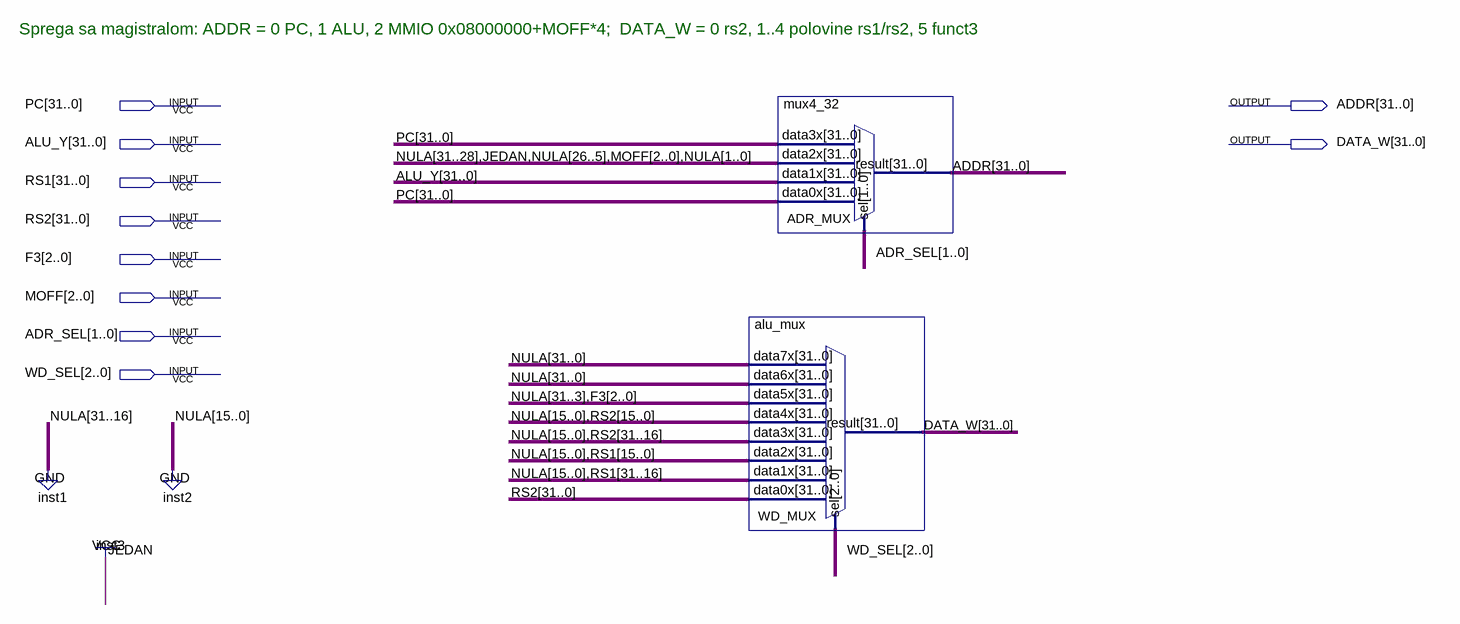
[diagram p0: schematic sheet]
// Quartus schematic data_mem.bdf as structural Verilog: 2 symbols, 10 pins
module data_mem (
  input  [31:0] PC,
  input  [31:0] ALU_Y,
  input  [31:0] RS1,
  input  [31:0] RS2,
  input  [2:0] F3,
  input  [2:0] MOFF,
  input  [1:0] ADR_SEL,
  input  [2:0] WD_SEL,
  output [31:0] ADDR,
  output [31:0] DATA_W
);

  mux4_32 ADR_MUX (
    .data3x(PC), .data2x({27'b000010000000000000000000000, MOFF, 2'b00}), .data1x(ALU_Y), .data0x(PC),
    .sel(ADR_SEL), .result(ADDR));
  alu_mux WD_MUX (
    .data7x({32{1'b0}}), .data6x({32{1'b0}}), .data5x({{29{1'b0}}, F3}), .data4x({{16{1'b0}}, RS2[15:0]}),
    .data3x({{16{1'b0}}, RS2[31:16]}), .data2x({{16{1'b0}}, RS1[15:0]}), .data1x({{16{1'b0}}, RS1[31:16]}),
    .data0x(RS2), .sel(WD_SEL), .result(DATA_W));

  // Notes on the sheet:
  //   Sprega sa magistralom: ADDR = 0 PC, 1 ALU, 2 MMIO 0x08000000+MOFF*4;  DATA_W = 0 rs2, 1..4 polovine rs1/rs2, 5 funct3
endmodule
